# Altium schematic sheet 01.Arduino and Interfaces.SchDoc
size A4
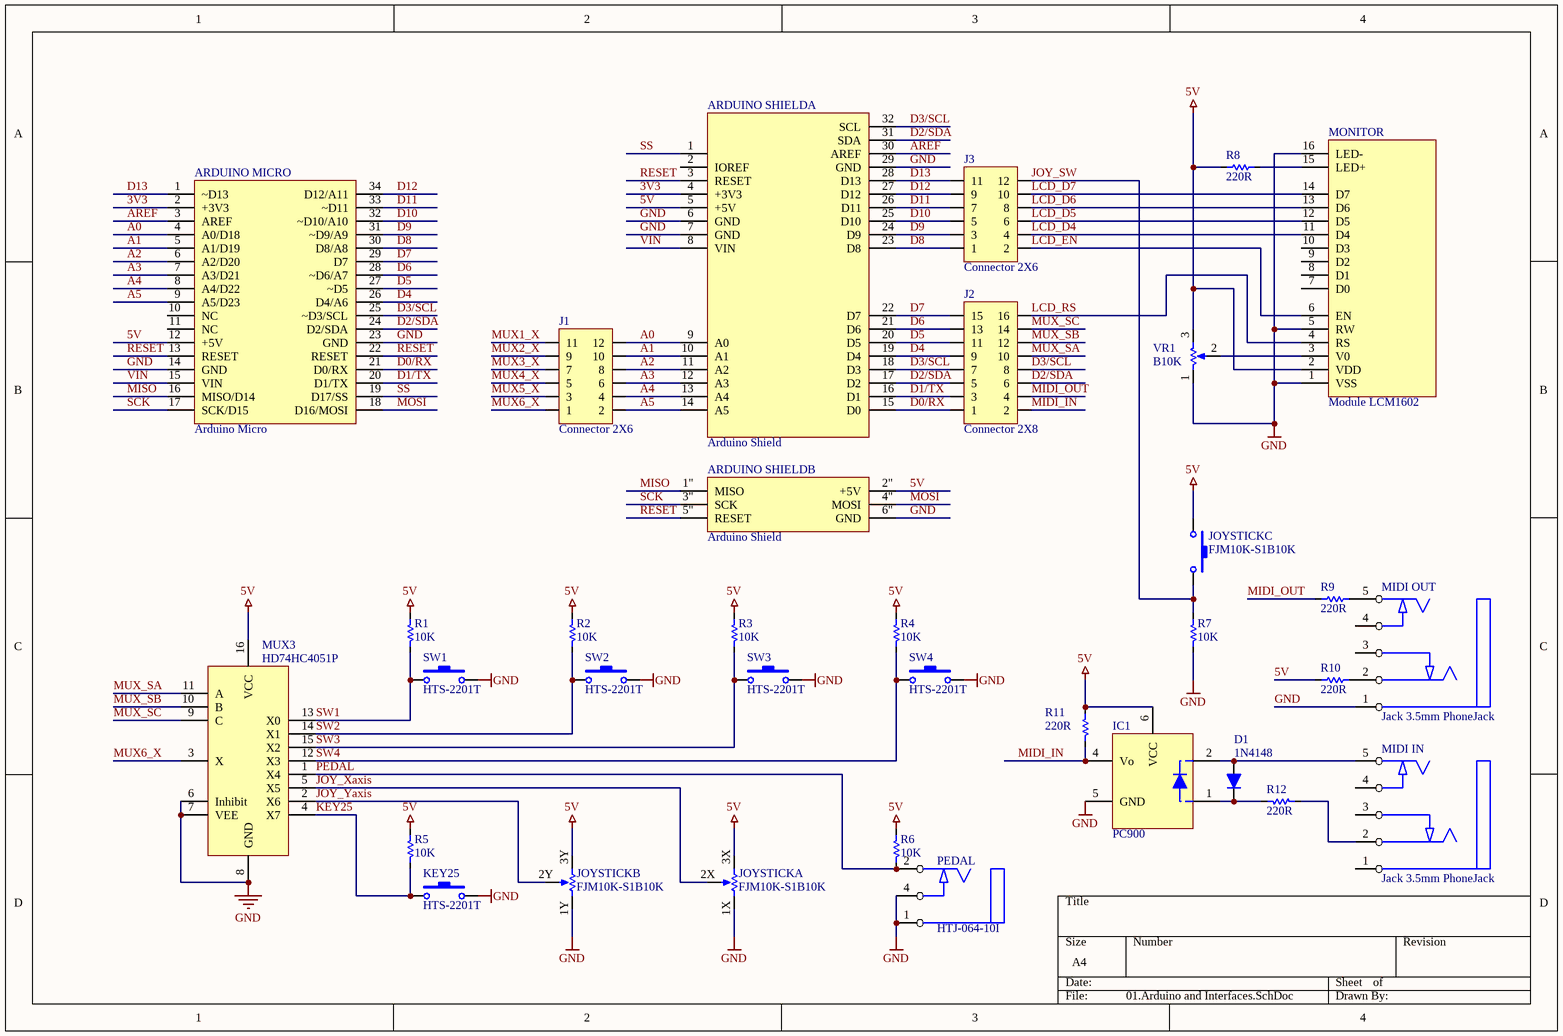
[diagram p0: 01.Arduino and Interfaces.SchDoc]

## Parts
ARDUINO_MICRO  Arduino Micro
ARDUINO_SHIELD  Arduino Shield  (parts A,B of 2)
D1  1N4148  [Diode]
IC1  PC900  [DIP-6]
J1  Connector 2X6  [A2541WV0-2X6P]
J2  Connector 2X8  [A2541WV0-2X8P]
J3  Connector 2X6  [A2541WV0-2X6P]
JOYSTICK  FJM10K-S1B10K  [Joystick FJM10K-S1B10K]  (parts A,B,C of 3)
KEY25  HTS-2201T  [ALPS-SKHC-12mm - NO SILK]
MIDI_IN  Jack 3.5mm PhoneJack  [PhoneJack EJ05-06-PF]
MIDI_OUT  Jack 3.5mm PhoneJack  [PhoneJack EJ05-06-PF]
MONITOR  Module LCM1602  [LCM1602]
MUX3  HD74HC4051P  [DIP-16]
PEDAL  HTJ-064-10I  [HTJ-064-10I]
R1  10K  [Res 1/4W]
R2  10K  [Res 1/4W]
R3  10K  [Res 1/4W]
R4  10K  [Res 1/4W]
R5  10K  [Res 1/4W]
R6  10K  [Res 1/4W]
R7  10K  [Res 1/4W]
R8  220R  [Res 1/4W]
R9  220R  [Res 1/4W]
R10  220R  [Res 1/4W]
R11  220R  [Res 1/4W]
R12  220R  [Res 1/4W]
SW1  HTS-2201T  [ALPS-SKHC-12mm]
SW2  HTS-2201T  [ALPS-SKHC-12mm]
SW3  HTS-2201T  [ALPS-SKHC-12mm]
SW4  HTS-2201T  [ALPS-SKHC-12mm]
VR1  B10K  [RV100F-30]

## Nets
5V: ARDUINO_MICRO.12(+5V) ARDUINO_SHIELD.2"(+5V) ARDUINO_SHIELD.5(+5V) IC1.6(VCC) JOYSTICK.3X JOYSTICK.3Y JOYSTICK.6 MONITOR.2(VDD) MUX3.16(VCC) R1.1 R2.1 R3.1 R4.1 R5.1 R6.1 R8.1 R10.2 R11.2 VR1.3
GND: ARDUINO_MICRO.14(GND) ARDUINO_MICRO.23(GND) ARDUINO_SHIELD.6(GND) ARDUINO_SHIELD.6"(GND) ARDUINO_SHIELD.7(GND) ARDUINO_SHIELD.29(GND) IC1.5(GND) JOYSTICK.1X JOYSTICK.1Y KEY25.1 MIDI_OUT.1 MONITOR.1(VSS) MONITOR.5(RW) MONITOR.16(LED-) MUX3.6(Inhibit) MUX3.7(VEE) MUX3.8(GND) PEDAL.1 PEDAL.4 R7.2 SW1.1 SW2.1 SW3.1 SW4.1 VR1.1
3V3: ARDUINO_MICRO.2(+3V3) ARDUINO_SHIELD.4(+3V3)
A0: ARDUINO_MICRO.4(A0/D18) ARDUINO_SHIELD.9(A0) J1.12
A1: ARDUINO_MICRO.5(A1/D19) ARDUINO_SHIELD.10(A1) J1.10
A2: ARDUINO_MICRO.6(A2/D20) ARDUINO_SHIELD.11(A2) J1.8
A3: ARDUINO_MICRO.7(A3/D21) ARDUINO_SHIELD.12(A3) J1.6
A4: ARDUINO_MICRO.8(A4/D22) ARDUINO_SHIELD.13(A4) J1.4
A5: ARDUINO_MICRO.9(A5/D23) ARDUINO_SHIELD.14(A5) J1.2
AREF: ARDUINO_MICRO.3(AREF) ARDUINO_SHIELD.30(AREF)
D0/RX: ARDUINO_MICRO.21(D0/RX) ARDUINO_SHIELD.15(D0) J2.1
D1/TX: ARDUINO_MICRO.20(D1/TX) ARDUINO_SHIELD.16(D1) J2.3
D2/SDA: ARDUINO_MICRO.24(D2/SDA) ARDUINO_SHIELD.17(D2) ARDUINO_SHIELD.31(SDA) J2.5 J2.6
D3/SCL: ARDUINO_MICRO.25(~D3/SCL) ARDUINO_SHIELD.18(D3) ARDUINO_SHIELD.32(SCL) J2.7 J2.8
D4: ARDUINO_MICRO.26(D4/A6) ARDUINO_SHIELD.19(D4) J2.9
D5: ARDUINO_MICRO.27(~D5) ARDUINO_SHIELD.20(D5) J2.11
D6: ARDUINO_MICRO.28(~D6/A7) ARDUINO_SHIELD.21(D6) J2.13
D7: ARDUINO_MICRO.29(D7) ARDUINO_SHIELD.22(D7) J2.15
D8: ARDUINO_MICRO.30(D8/A8) ARDUINO_SHIELD.23(D8) J3.1
D9: ARDUINO_MICRO.31(~D9/A9) ARDUINO_SHIELD.24(D9) J3.3
D10: ARDUINO_MICRO.32(~D10/A10) ARDUINO_SHIELD.25(D10) J3.5
D11: ARDUINO_MICRO.33(~D11) ARDUINO_SHIELD.26(D11) J3.7
D12: ARDUINO_MICRO.34(D12/A11) ARDUINO_SHIELD.27(D12) J3.9
D13: ARDUINO_MICRO.1(~D13) ARDUINO_SHIELD.28(D13) J3.11
JOY_SW: J3.12 JOYSTICK.5 R7.1
JOY_Xaxis: JOYSTICK.2X MUX3.5(X5)
JOY_Yaxis: JOYSTICK.2Y MUX3.2(X6)
KEY25: KEY25.2 MUX3.4(X7) R5.2
LCD_D4: J3.4 MONITOR.11(D4)
LCD_D5: J3.6 MONITOR.12(D5)
LCD_D6: J3.8 MONITOR.13(D6)
LCD_D7: J3.10 MONITOR.14(D7)
LCD_EN: J3.2 MONITOR.6(EN)
LCD_RS: J2.16 MONITOR.4(RS)
MIDI_IN: IC1.4(Vo) J2.2 R11.1
MIDI_OUT: J2.4 R9.2
MISO: ARDUINO_MICRO.16(MISO/D14) ARDUINO_SHIELD.1"(MISO)
MOSI: ARDUINO_MICRO.18(D16/MOSI) ARDUINO_SHIELD.4"(MOSI)
MUX1_X: J1.11
MUX2_X: J1.9
MUX3_X: J1.7
MUX4_X: J1.5
MUX5_X: J1.3
MUX6_X: J1.1 MUX3.3(X)
MUX_SA: J2.10 MUX3.11(A)
MUX_SB: J2.12 MUX3.10(B)
MUX_SC: J2.14 MUX3.9(C)
PEDAL: MUX3.1(X4) PEDAL.2 R6.2
RESET: ARDUINO_MICRO.13(RESET) ARDUINO_MICRO.22(RESET) ARDUINO_SHIELD.3(RESET) ARDUINO_SHIELD.5"(RESET)
SCK: ARDUINO_MICRO.17(SCK/D15) ARDUINO_SHIELD.3"(SCK)
SS: ARDUINO_MICRO.19(D17/SS) ARDUINO_SHIELD.1
SW1: MUX3.13(X0) R1.2 SW1.2
SW2: MUX3.14(X1) R2.2 SW2.2
SW3: MUX3.15(X2) R3.2 SW3.2
SW4: MUX3.12(X3) R4.2 SW4.2
VIN: ARDUINO_MICRO.15(VIN) ARDUINO_SHIELD.8(VIN)
NetD1_1: D1.1 IC1.2 MIDI_IN.5
NetD1_2: D1.2 IC1.1 R12.2
NetMIDI_IN_2: MIDI_IN.2 R12.1
NetMIDI_OUT_2: MIDI_OUT.2 R10.1
NetMIDI_OUT_5: MIDI_OUT.5 R9.1
NetMONITOR_3: MONITOR.3(V0) VR1.2
NetMONITOR_15: MONITOR.15(LED+) R8.2

Not connected (* = marked no-connect by the designer): ARDUINO_MICRO 10(NC) 11(NC); ARDUINO_SHIELD 2(IOREF); MIDI_IN 1 3 4; MIDI_OUT 3 4; MONITOR 7(D0) 8(D1) 9(D2) 10(D3)

## Library data of the parts
ARDUINO_MICRO = Arduino Micro: Arduino Micro Board
D1 = Diode 1N4148
IC1 = Optoisolator PC900: Sharp PC900 Optoisolator
JOYSTICK = Joystick with Sw
KEY25 SW1-SW4 = Tact Switch HTS-2201T
MUX3 = TC74HC4051AF
R1-R12 = Resistor
VR1 = VR Mono